# EasyEDA schematic SCH_SCore-SR1_2025-01-31.json
TITLE: SSR1 PCB; REV: 1.4; Date: 2024-1-22; Sheet: 1/1; Drawn By: Austen B; Company: MilliByte, LLC
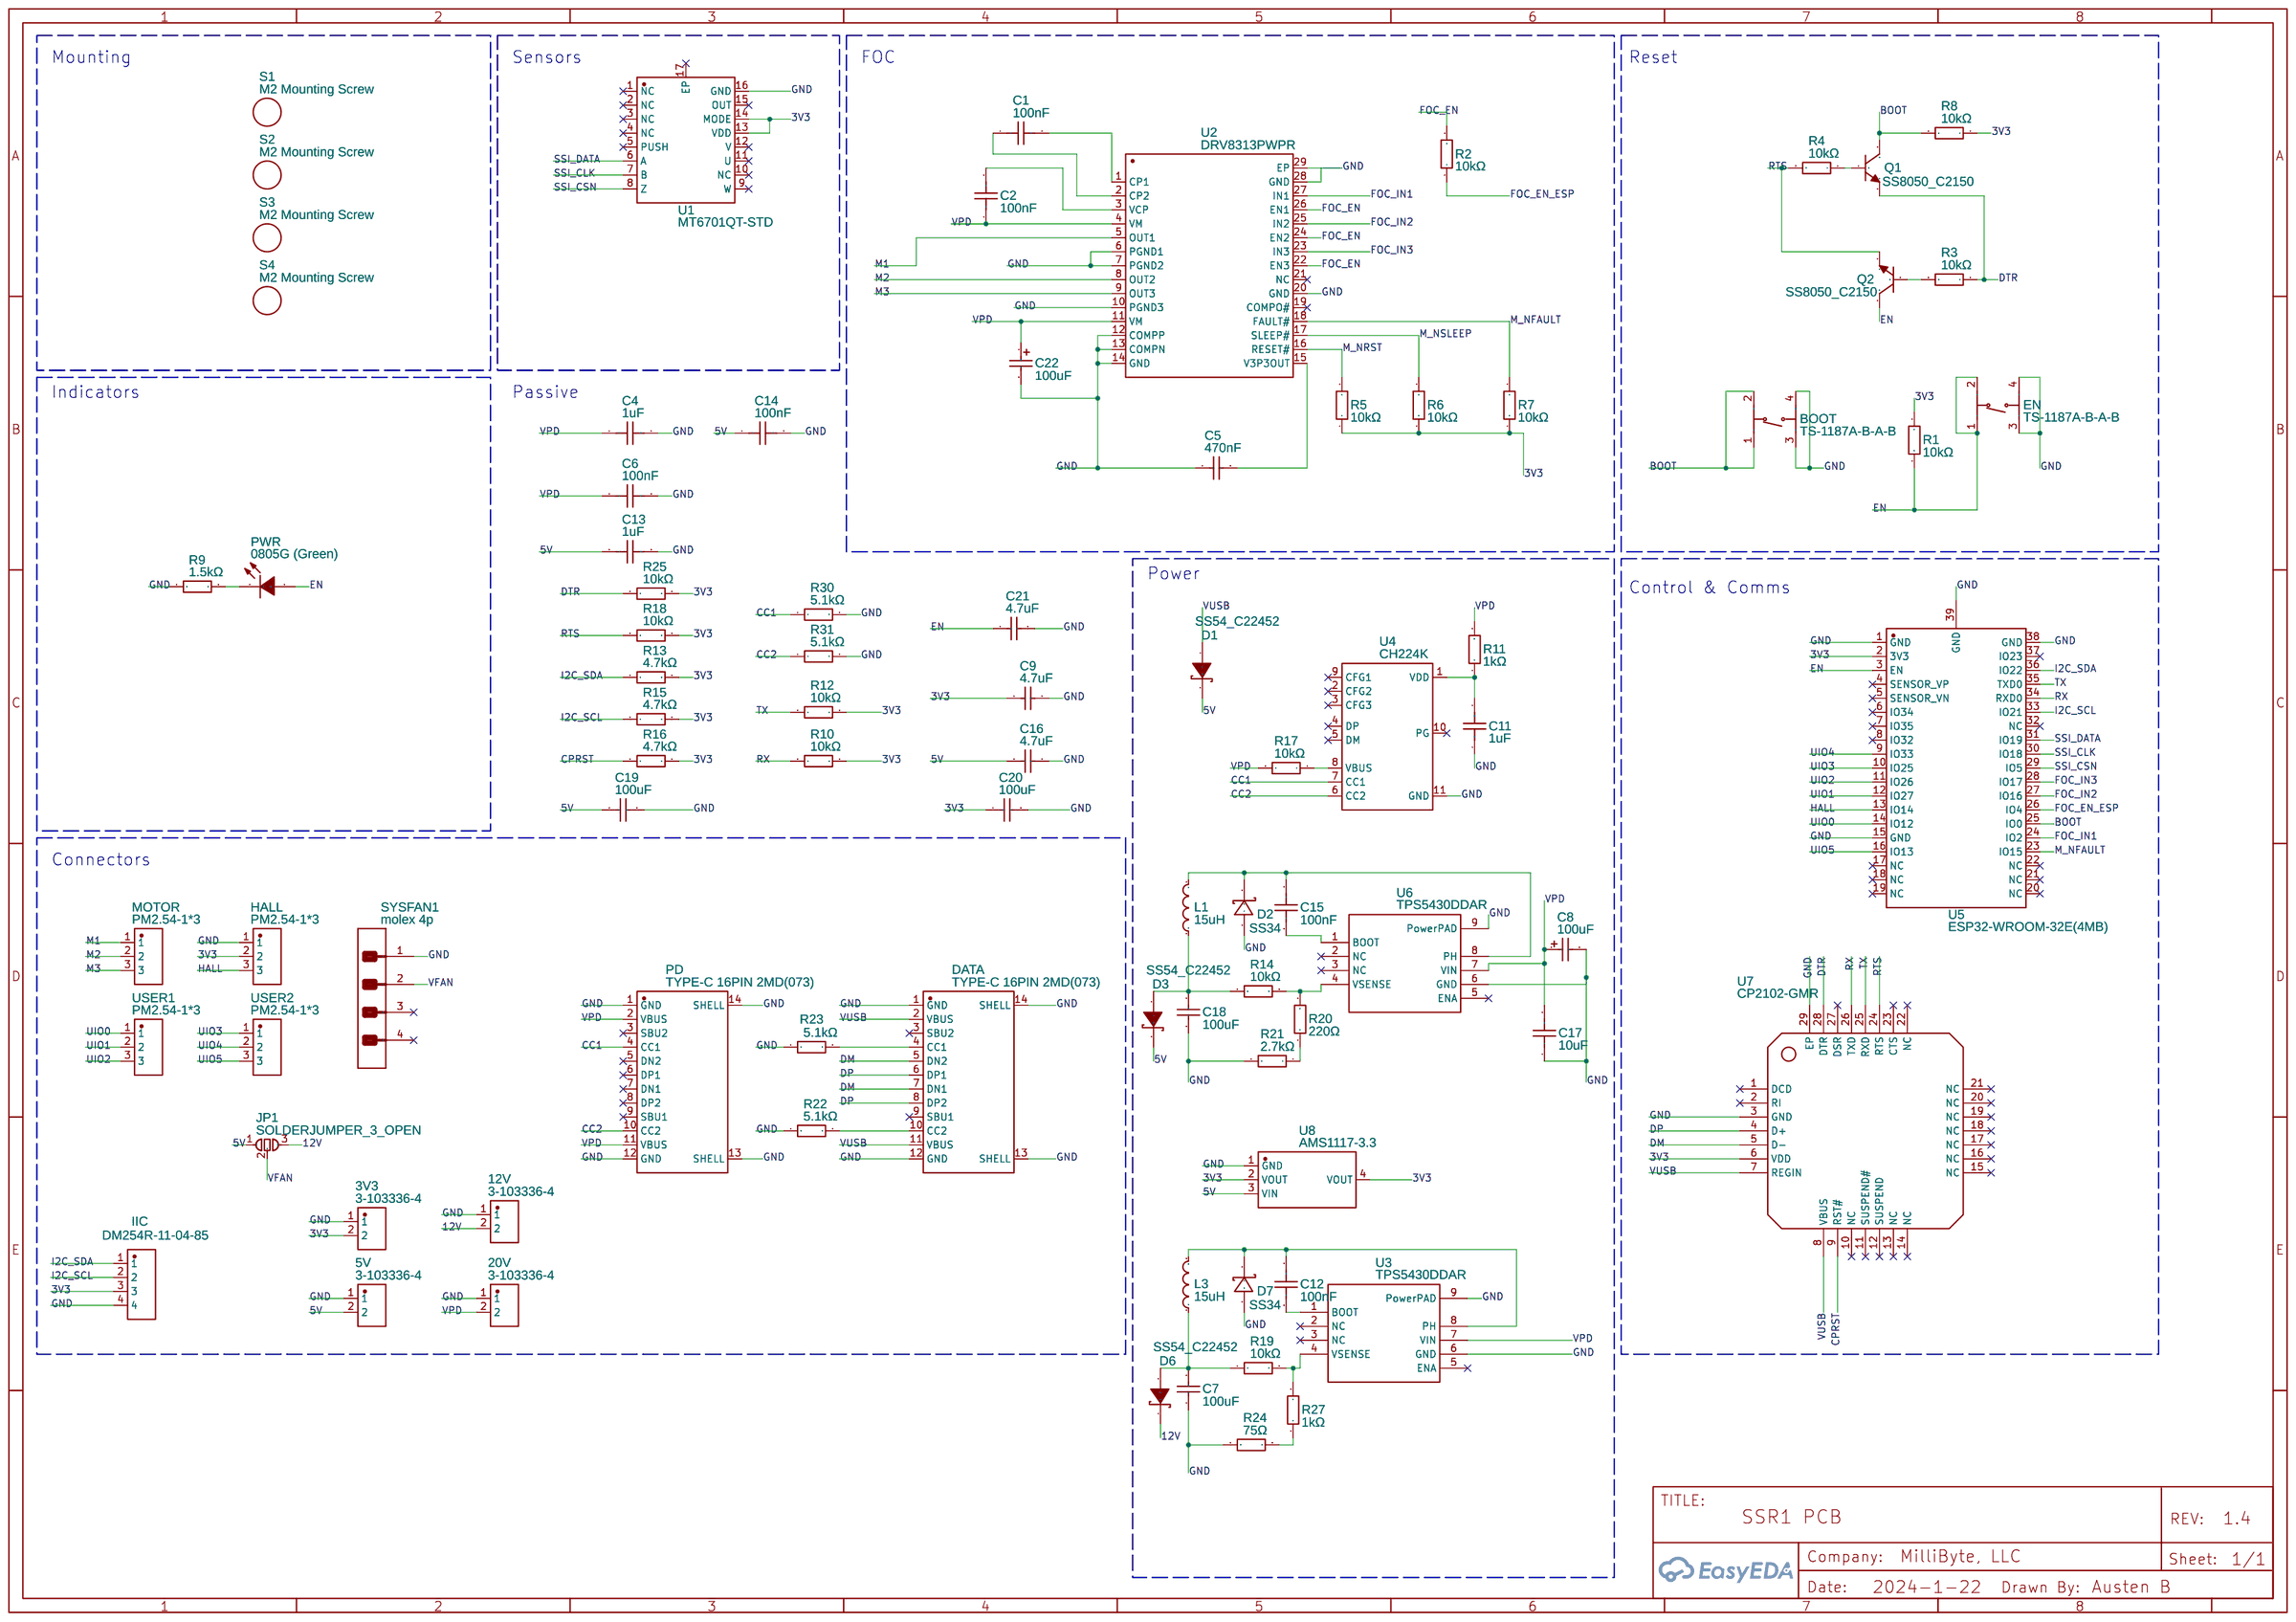
[diagram p0: schematic sheet]

## Parts
3V3  3-103336-4  [HDR-TH_2P-P2.54-V-M-1]
5V  3-103336-4  [HDR-TH_2P-P2.54-V-M-1]
12V  3-103336-4  [HDR-TH_2P-P2.54-V-M-1]
20V  3-103336-4  [HDR-TH_2P-P2.54-V-M-1]
BOOT  TS-1187A-B-A-B  [SW-SMD_4P-L5.1-W5.1-P3.70-LS6.5-TL-2]
C1  100nF  [C0603]
C2  100nF  [C0603]
C4  1uF  [C0603]
C5  470nF  [C0805]
C6  100nF  [C0603]
C7  100uF  [C1206]
C8  100uF  [CAP-SMD_L7.3-W4.3-R-RD]
C9  4.7uF  [C0402]
C11  1uF  [C0603]
C12  100nF  [C0603]
C13  1uF  [C0603]
C14  100nF  [C0603]
C15  100nF  [C0603]
C16  4.7uF  [C0402]
C17  10uF  [C0805]
C18  100uF  [C1206]
C19  100uF  [C1206]
C20  100uF  [C1206]
C21  4.7uF  [C0402]
C22  100uF  [CAP-SMD_L7.3-W4.3-R-RD]
D1  SS54_C22452  [SMA_L4.4-W2.8-LS5.4-R-RD]
D2  SS34  [SMA_L4.3-W2.6-LS5.2-RD]
D3  SS54_C22452  [SMA_L4.4-W2.8-LS5.4-R-RD]
D6  SS54_C22452  [SMA_L4.4-W2.8-LS5.4-R-RD]
D7  SS34  [SMA_L4.3-W2.6-LS5.2-RD]
DATA  TYPE-C 16PIN 2MD(073)  [USB-C-SMD_TYPE-C-6PIN-2MD-073]
EN  TS-1187A-B-A-B  [SW-SMD_4P-L5.1-W5.1-P3.70-LS6.5-TL-2]
HALL  PM2.54-1*3  [HDR-TH_3P-P2.54-V-F]
IIC  DM254R-11-04-85  [HDR-TH_4P-P2.54-V-F]
JP1  SOLDERJUMPER_3_OPEN  [JUMPER:SOLDERJUMPER-3_P1.3MM_BRIDGED12_PAD1.0X1.5MM COPY]
L1  15uH  [IND-SMD_L7.3-W6.8]
L3  15uH  [IND-SMD_L7.3-W6.8]
MOTOR  PM2.54-1*3  [HDR-TH_3P-P2.54-V-F]
PD  TYPE-C 16PIN 2MD(073)  [USB-C-SMD_TYPE-C-6PIN-2MD-073]
PWR  0805G (Green)  [LED0805-R-RD]
Q1  SS8050_C2150  [SOT-23-3_L2.9-W1.3-P1.90-LS2.4-BR]
Q2  SS8050_C2150  [SOT-23-3_L2.9-W1.3-P1.90-LS2.4-BR]
R1  10kΩ  [R0402]
R2  10kΩ  [R0603]
R3  10kΩ  [R0402]
R4  10kΩ  [R0402]
R5  10kΩ  [R0402]
R6  10kΩ  [R0402]
R7  10kΩ  [R0402]
R8  10kΩ  [R0402]
R9  1.5kΩ  [R0603]
R10  10kΩ  [R0402]
R11  1kΩ  [R0402]
R12  10kΩ  [R0402]
R13  4.7kΩ  [R0402]
R14  10kΩ  [R0402]
R15  4.7kΩ  [R0402]
R16  4.7kΩ  [R0402]
R17  10kΩ  [R0402]
R18  10kΩ  [R0402]
R19  10kΩ  [R0402]
R20  220Ω  [R0603]
R21  2.7kΩ  [R0603]
R22  5.1kΩ  [R0402]
R23  5.1kΩ  [R0402]
R24  75Ω  [R0603]
R25  10kΩ  [R0402]
R27  1kΩ  [R0603]
R30  5.1kΩ  [R0402]
R31  5.1kΩ  [R0402]
S1  M2 Mounting Screw  [MOUNTINGHOLE_2.2MM_M2_PAD]
S2  M2 Mounting Screw  [MOUNTINGHOLE_2.2MM_M2_PAD]
S3  M2 Mounting Screw  [MOUNTINGHOLE_2.2MM_M2_PAD]
S4  M2 Mounting Screw  [MOUNTINGHOLE_2.2MM_M2_PAD]
SYSFAN1  molex 4p  [MOLEX---47053-1000_MOLEX]
U1  MT6701QT-STD  [QFN-16_L3.0-W3.0-P0.50-TL-EP]
U2  DRV8313PWPR  [HTSSOP-28_L9.8-W4.5-P0.65-LS6.6-BL-EP]
U3  TPS5430DDAR  [ESOP-8_L4.9-W3.9-P1.27-LS6.0-TL-EP]
U4  CH224K  [ESSOP-10_L4.9-W3.9-P1.0-LS6.0-TL-EP]
U5  ESP32-WROOM-32E(4MB)  [WIFI-SMD_ESP32-WROOM-32E]
U6  TPS5430DDAR  [ESOP-8_L4.9-W3.9-P1.27-LS6.0-TL-EP]
U7  CP2102-GMR  [WQFN-28_L5.0-W5.0-P0.50-BL-EP3.2]
U8  AMS1117-3.3  [SOT-223-3_L6.5-W3.4-P2.30-LS7.0-BR]
USER1  PM2.54-1*3  [HDR-TH_3P-P2.54-V-F]
USER2  PM2.54-1*3  [HDR-TH_3P-P2.54-V-F]

## Library data of the parts
3V3 5V 12V 20V = 3-103336-4: Supplier: LCSC; Supplier Part: C6802999; Manufacturer: TE Connectivity(泰科电子); Contributor: lcsc
BOOT EN = TS-1187A-B-A-B: Contributor: LCSC; Supplier: LCSC; Supplier Part: C318884; Manufacturer: XKB Connectivity(中国星坤); JLCPCB Part Class: Basic Part
C1 C2 C6 C12 C14 C15 = CC0603KRX7R9BB104: Supplier: LCSC; Manufacturer: YAGEO(国巨); Supplier Part: C14663; JLCPCB Part Class: Basic Part
C4 C11 C13 = CL10A105KB8NNNC: Supplier: LCSC; Manufacturer: SAMSUNG(三星); Supplier Part: C15849; JLCPCB Part Class: Basic Part
C5 = CL21B474KBFNNNE: Supplier: LCSC; Manufacturer: SAMSUNG(三星); Supplier Part: C13967; JLCPCB Part Class: Basic Part; Contributor: eisendev
C7 C18-C20 = CL31A107MQHNNNE: Supplier: LCSC; Manufacturer: SAMSUNG(三星); Supplier Part: C15008; JLCPCB Part Class: Basic Part
C8 C22 = 20TQC100MYF: Supplier: LCSC; Manufacturer: PANASONIC(松下); Supplier Part: C139578; JLCPCB Part Class: Extended Part
C9 C16 C21 = CL05A475MP5NRNC: Supplier: LCSC; Manufacturer: SAMSUNG(三星); Supplier Part: C23733; JLCPCB Part Class: Basic Part
C17 = CL21A106KAYNNNE: Supplier: LCSC; Manufacturer: SAMSUNG(三星); Supplier Part: C15850; JLCPCB Part Class: Basic Part
D1 D3 D6 = SS54_C22452: Supplier: LCSC; Manufacturer Part: SS54; Manufacturer: MDD; Supplier Part: C22452; JLCPCB Part Class: Basic Part; link: https://lcsc.com/eda_search?q=C22452&%26type=1&ref=editor; Contributor: mtz8302
D2 D7 = SS34_C8678: Supplier: LCSC; Manufacturer: MDD(辰达半导体); Supplier Part: C8678; JLCPCB Part Class: Basic Part
DATA PD = TYPE-C 16PIN 2MD(073): Contributor: LCSC; Supplier: LCSC; Supplier Part: C2765186; Manufacturer: SHOU HAN(首韩); JLCPCB Part Class: Extended Part
HALL MOTOR USER1 USER2 = PM2.54-1*3: Supplier: LCSC; Supplier Part: C5116529; Manufacturer: ZHOURI(洲日); JLCPCB Part Class: Extended Part; Contributor: lcsc
IIC = DM254R-11-04-85: Contributor: LCSC; Supplier: LCSC; Supplier Part: C2935975; Manufacturer: DEALON(德艺隆); JLCPCB Part Class: Extended Part
JP1 = SOLDERJUMPER_3_OPEN: Symbol: SolderJumper_3_Open; Device: SolderJumper_3_Open; Add into BOM: yes; Convert to PCB: yes; Contributor: mtz8302
L1 L3 = MWSA0603S-150MT: Contributor: LCSC; Supplier: LCSC; Supplier Part: C408452; Manufacturer: Sunlord(顺络); JLCPCB Part Class: Extended Part
PWR = 0805G (Green): Supplier: LCSC; Manufacturer: KENTO; Manufacturer Part: KT-0805G; Supplier Part: C2297; JLCPCB Part Class: Basic Part
Q1 Q2 = SS8050_C2150: Supplier: LCSC; Manufacturer: CJ(江苏长电/长晶); Manufacturer Part: SS8050; Supplier Part: C2150; JLCPCB Part Class: Basic Part
R1 R3-R8 R10 R12 R14 R17-R19 R25 = 0402WGF1002TCE: Supplier: LCSC; Manufacturer: UNI-ROYAL(厚声); Supplier Part: C25744; JLCPCB Part Class: Basic Part
R2 = 0603WAF1002T5E: Supplier: LCSC; Manufacturer: UNI-ROYAL(厚声); Supplier Part: C25804; JLCPCB Part Class: Basic Part
R9 = 0603WAF1501T5E: Supplier: LCSC; Manufacturer: UNI-ROYAL(厚声); Supplier Part: C22843; JLCPCB Part Class: Basic Part
R11 = 0402WGF1001TCE: Supplier: LCSC; Manufacturer: UNI-ROYAL(厚声); Supplier Part: C11702; JLCPCB Part Class: Basic Part
R13 R15 R16 = 0402WGF4701TCE: Supplier: LCSC; Manufacturer: UNI-ROYAL(厚声); Supplier Part: C25900; JLCPCB Part Class: Basic Part
R20 = 0603WAF2200T5E: Supplier: LCSC; Manufacturer: UNI-ROYAL(厚声); Supplier Part: C22962; JLCPCB Part Class: Basic Part
R21 = 0603WAF2701T5E: Supplier: LCSC; Manufacturer: UniOhm; Supplier Part: C13167; Resistance (Ohms): 2.7K; JLCPCB Part Class: Basic Part; Contributor: kliu24
R22 R23 R30 R31 = 0402WGF5101TCE: Supplier: LCSC; Manufacturer: UNI-ROYAL(厚声); Supplier Part: C25905; JLCPCB Part Class: Basic Part
R24 = 0603WAF750JT5E: Supplier: LCSC; Manufacturer: UNI-ROYAL(厚声); Supplier Part: C4275; JLCPCB Part Class: Basic Part
R27 = 0603WAF1001T5E: Supplier: LCSC; Manufacturer: UNI-ROYAL(厚声); Supplier Part: C21190; JLCPCB Part Class: Basic Part
S1-S4 = M2 Mounting Screw: Contributor: Dayat -
SYSFAN1 = molex 4p: Contributor: delil1220
U1 = MT6701QT-STD: Contributor: LCSC; Supplier: LCSC; Supplier Part: C2913974; Manufacturer: MagnTek(麦歌恩); JLCPCB Part Class: Extended Part
U2 = DRV8313PWPR: Supplier: LCSC; Supplier Part: C92482; Manufacturer: Texas Instruments; Contributor: LCSC; JLCPCB Part Class: Extended Part
U3 U6 = TPS5430DDAR: Supplier: LCSC; Manufacturer: TI(德州仪器); Supplier Part: C9864; JLCPCB Part Class: Basic Part
U4 = CH224K: Contributor: lcsc; Supplier: LCSC; Supplier Part: C970725; Manufacturer: WCH(南京沁恒); JLCPCB Part Class: Extended Part
U5 = ESP32-WROOM-32E(4MB): Contributor: LCSC; Supplier: LCSC; Supplier Part: C701341; Manufacturer: ESPRESSIF(乐鑫); Manufacturer Part: ESP32-WROOM-32E-N4; JLCPCB Part Class: Extended Part
U7 = CP2102-GMR: Supplier: LCSC; Manufacturer: SKYWORKS/SILICON LABS(芯科); Supplier Part: C6568; JLCPCB Part Class: Extended Part
U8 = AMS1117-3.3: sourceId: dwIGgezVh; Supplier: LCSC; Manufacturer: AMS; Supplier Part: C6186; JLCPCB Part Class: Basic Part

## Nets
3V3: 3V3.2 C9.1 C20.1 HALL.2 IIC.3 R1.2 R5.1 R6.1 R7.1 R8.1 R10.2 R12.2 R13.2 R15.2 R16.2 R18.2 R25.2 U1.13(VDD) U1.14(MODE) U5.2(3V3) U7.6(VDD) U8.2(VOUT) U8.4(VOUT)
5V: 5V.2 C13.1 C14.1 C16.1 C19.1 D1.2(K) D3.2(K) JP1.1(A) U8.3(VIN)
12V: 12V.2 D6.2(K) JP1.3(B)
GND: 3V3.1 5V.1 12V.1 20V.1 BOOT.3(C) BOOT.4(D) C4.2 C5.1 C6.2 C7.1 C8.2 C9.2 C11.1 C13.2 C14.2 C16.2 C17.1 C18.1 C19.2 C20.2 C21.2 C22.2 D2.2(A) D7.2(A) DATA.1(GND) DATA.12(GND) DATA.13(SHELL) DATA.14(SHELL) EN.3(C) EN.4(D) HALL.1 IIC.4 PD.1(GND) PD.12(GND) PD.13(SHELL) PD.14(SHELL) R9.1 R21.2 R22.1 R23.1 R24.1 R30.2 R31.2 SYSFAN1.1 U1.16(GND) U2.6(PGND1) U2.7(PGND2) U2.10(PGND3) U2.12(COMPP) U2.13(COMPN) U2.14(GND) U2.20(GND) U2.28(GND) U2.29(EP) U3.6(GND) U3.9(PowerPAD) U4.11(GND) U5.1(GND) U5.15(GND) U5.38(GND) U5.39(GND) U6.6(GND) U6.9(PowerPAD) U7.3(GND) U7.29(EP) U8.1(GND)
BOOT: BOOT.1(A) BOOT.2(B) Q1.3(C) R8.2 U5.25(IO0)
CC1: PD.4(CC1) R30.1 U4.7(CC1)
CC2: PD.10(CC2) R31.1 U4.6(CC2)
CPRST: R16.1 U7.9(RST#)
DM: DATA.5(DN2) DATA.7(DN1) U7.5(D-)
DP: DATA.6(DP1) DATA.8(DP2) U7.4(D+)
DTR: Q1.2(E) R3.1 R25.1 U7.28(DTR)
EN: C21.1 EN.1(A) EN.2(B) PWR.1(A) Q2.3(C) R1.1 U5.3(EN)
FOC_EN: R2.2 U2.22(EN3) U2.24(EN2) U2.26(EN1)
FOC_EN_ESP: R2.1 U5.26(IO4)
FOC_IN1: U2.27(IN1) U5.24(IO2)
FOC_IN2: U2.25(IN2) U5.27(IO16)
FOC_IN3: U2.23(IN3) U5.28(IO17)
HALL: HALL.3 U5.13(IO14)
I2C_SCL: IIC.2 R15.1 U5.33(IO21)
I2C_SDA: IIC.1 R13.1 U5.36(IO22)
M1: MOTOR.1 U2.5(OUT1)
M2: MOTOR.2 U2.8(OUT2)
M3: MOTOR.3 U2.9(OUT3)
M_NFAULT: R7.2 U2.18(FAULT#) U5.23(IO15)
M_NRST: R5.2 U2.16(RESET#)
M_NSLEEP: R6.2 U2.17(SLEEP#)
RTS: Q2.2(E) R4.2 R18.1 U7.24(RTS)
RX: R10.1 U5.34(RXD0) U7.26(TXD)
SSI_CLK: U1.7(B) U5.30(IO18)
SSI_CSN: U1.8(Z) U5.29(IO5)
SSI_DATA: U1.6(A) U5.31(IO19)
TX: R12.1 U5.35(TXD0) U7.25(RXD)
UIO0: U5.14(IO12) USER1.1
UIO1: U5.12(IO27) USER1.2
UIO2: U5.11(IO26) USER1.3
UIO3: U5.10(IO25) USER2.1
UIO4: U5.9(IO33) USER2.2
UIO5: U5.16(IO13) USER2.3
VFAN: JP1.2(C) SYSFAN1.2
VPD: 20V.2 C2.1 C4.1 C6.1 C8.1 C17.2 C22.1 PD.2(VBUS) PD.11(VBUS) R11.2 R17.2 U2.4(VM) U2.11(VM) U3.7(VIN) U6.7(VIN)
VUSB: D1.1(A) DATA.2(VBUS) DATA.11(VBUS) U7.7(REGIN) U7.8(VBUS)
Net-(C1-1): C1.1 U2.2(CP2)
Net-(C1-2): C1.2 U2.1(CP1)
Net-(C2-2): C2.2 U2.3(VCP)
Net-(C5-2): C5.2 U2.15(V3P3OUT)
Net-(C7-2): C7.2 D6.1(A) L3.1 R19.1
Net-(C11-2): C11.2 R11.1 U4.1(VDD)
Net-(C12-1): C12.1 D7.1(K) L3.2 U3.8(PH)
Net-(C12-2): C12.2 U3.1(BOOT)
Net-(C15-1): C15.1 D2.1(K) L1.2 U6.8(PH)
Net-(C15-2): C15.2 U6.1(BOOT)
Net-(C18-2): C18.2 D3.1(A) L1.1 R14.1
Net-(DATA-4): DATA.4(CC1) R23.2
Net-(DATA-10): DATA.10(CC2) R22.2
Net-(PWR-2): PWR.2(K) R9.2
Net-(Q1-1): Q1.1(B) R4.1
Net-(Q2-1): Q2.1(B) R3.2
Net-(R14-2): R14.2 R20.2 U6.4(VSENSE)
Net-(R17-1): R17.1 U4.8(VBUS)
Net-(R19-2): R19.2 R27.2 U3.4(VSENSE)
Net-(R20-1): R20.1 R21.1
Net-(R24-2): R24.2 R27.1

Not connected (* = marked no-connect by the designer): DATA 3(SBU2)* 9(SBU1)*; PD 3(SBU2)* 5(DN2)* 6(DP1)* 7(DN1)* 8(DP2)* 9(SBU1)*; SYSFAN1 3* 4*; U1 1(NC)* 2(NC)* 3(NC)* 4(NC)* 5(PUSH)* 9(W)* 10(NC)* 11(U)* 12(V)* 15(OUT)* 17(EP)*; U2 19(COMPO#)* 21(NC)*; U3 2(NC)* 3(NC)* 5(ENA)*; U4 2(CFG2)* 3(CFG3)* 4(DP)* 5(DM)* 9(CFG1)* 10(PG)*; U5 4(SENSOR_VP)* 5(SENSOR_VN)* 6(IO34)* 7(IO35)* 8(IO32)* 17(NC)* 18(NC)* 19(NC)* 20(NC)* 21(NC)* 22(NC)* 32(NC)* 37(IO23)*; U6 2(NC)* 3(NC)* 5(ENA)*; U7 1(DCD)* 2(RI)* 10(NC)* 11(SUSPEND#)* 12(SUSPEND)* 13(NC)* 14(NC)* 15(NC)* 16(NC)* 17(NC)* 18(NC)* 19(NC)* 20(NC)* 21(NC)* 22(NC)* 23(CTS)* 27(DSR)*

## Notes on the sheet
- Mounting
- Sensors
- FOC
- Reset
- Indicators
- Passive
- Power
- Control & Comms
- Connectors
